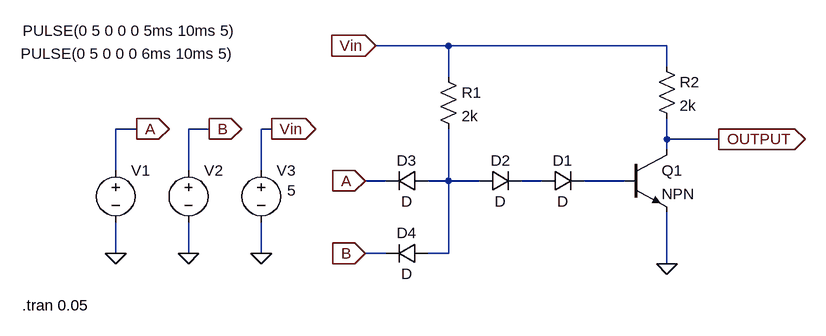
[diagram p0: schematic schematic1.asc]
schematic1.asc, the LTspice schematic file:
Version 4.1
SHEET 1 880 680
WIRE 112 -16 0 -16
WIRE 448 -16 112 -16
WIRE 448 16 448 -16
WIRE 112 32 112 -16
WIRE -368 112 -400 112
WIRE -256 112 -288 112
WIRE -160 112 -176 112
WIRE 448 128 448 96
WIRE 528 128 448 128
WIRE 448 144 448 128
WIRE -400 176 -400 112
WIRE -288 176 -288 112
WIRE -176 176 -176 112
WIRE 16 192 -16 192
WIRE 112 192 112 112
WIRE 112 192 80 192
WIRE 160 192 112 192
WIRE 256 192 224 192
WIRE 384 192 320 192
WIRE -400 304 -400 256
WIRE -288 304 -288 256
WIRE -176 304 -176 256
WIRE 16 304 -16 304
WIRE 112 304 112 192
WIRE 112 304 80 304
WIRE 448 320 448 240
FLAG 448 320 0
FLAG -400 304 0
FLAG -288 304 0
FLAG -176 304 0
FLAG -368 112 A
IOPIN -368 112 Out
FLAG -256 112 B
IOPIN -256 112 Out
FLAG -160 112 Vin
IOPIN -160 112 Out
FLAG -16 192 A
IOPIN -16 192 In
FLAG -16 304 B
IOPIN -16 304 In
FLAG 0 -16 Vin
IOPIN 0 -16 In
FLAG 528 128 OUTPUT
IOPIN 528 128 Out
SYMBOL res 96 16 R0
SYMATTR InstName R1
SYMATTR Value 2k
SYMBOL res 432 0 R0
SYMATTR InstName R2
SYMATTR Value 2k
SYMBOL diode 256 208 R270
WINDOW 0 32 32 VTop 2
WINDOW 3 0 32 VBottom 2
SYMATTR InstName D1
SYMBOL diode 160 208 R270
WINDOW 0 32 32 VTop 2
WINDOW 3 0 32 VBottom 2
SYMATTR InstName D2
SYMBOL diode 80 176 R90
WINDOW 0 0 32 VBottom 2
WINDOW 3 32 32 VTop 2
SYMATTR InstName D3
SYMBOL diode 80 288 R90
WINDOW 0 0 32 VBottom 2
WINDOW 3 32 32 VTop 2
SYMATTR InstName D4
SYMBOL npn 384 144 R0
SYMATTR InstName Q1
SYMBOL voltage -400 160 R0
WINDOW 3 -143 -199 Left 2
WINDOW 123 0 0 Left 0
WINDOW 39 0 0 Left 0
SYMATTR InstName V1
SYMATTR Value PULSE(0 5 0 0 0 5ms 10ms 5)
SYMBOL voltage -288 160 R0
WINDOW 3 -258 -164 Left 2
WINDOW 123 0 0 Left 0
WINDOW 39 0 0 Left 0
SYMATTR InstName V2
SYMATTR Value PULSE(0 5 0 0 0 6ms 10ms 5)
SYMBOL voltage -176 160 R0
WINDOW 3 40 47 Left 2
WINDOW 123 0 0 Left 0
WINDOW 39 0 0 Left 0
SYMATTR InstName V3
SYMATTR Value 5
TEXT -544 384 Left 2 !.tran 0.05

The netlist it stands for:
* schematic1.asc
R1 Vin N001 2k
R2 Vin OUTPUT 2k
D1 N002 N003 D
D2 N001 N002 D
D3 N001 A D
D4 N001 B D
Q1 OUTPUT N003 0 0 NPN
V1 A 0 PULSE(0 5 0 0 0 5ms 10ms 5)
V2 B 0 PULSE(0 5 0 0 0 6ms 10ms 5)
V3 Vin 0 5
.model D D
.lib standard.dio
.model NPN NPN
.model PNP PNP
.lib standard.bjt
.tran 0.05
.backanno
.end